# EAGLE design final_mouse (EAGLE 7.3.0)
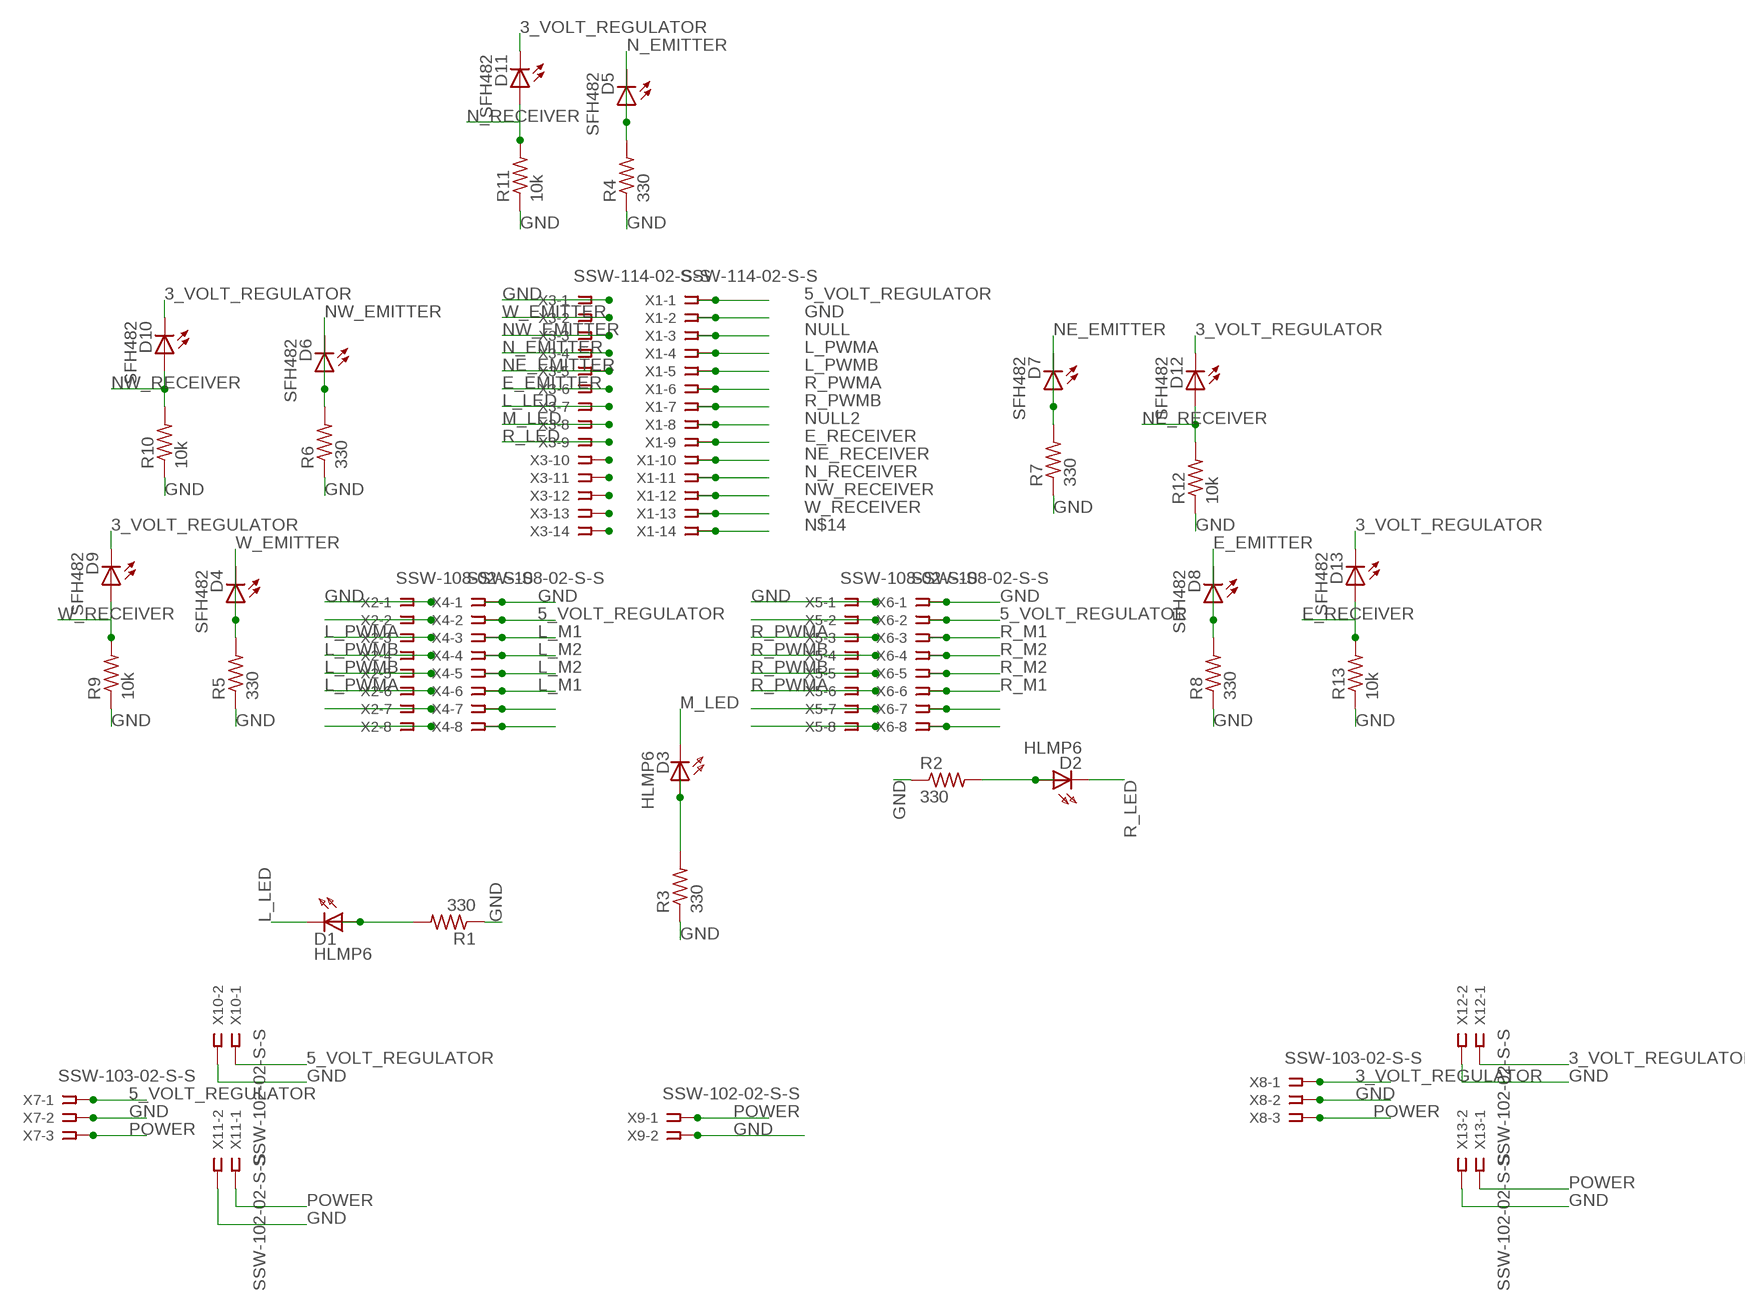
[diagram p0: schematic, sheet 1]

## Parts
D1  HLMP6  [HLMP6]
D2  HLMP6  [HLMP6]
D3  HLMP6  [HLMP6]
D4  SFH482  [SFH482]
D5  SFH482  [SFH482]
D6  SFH482  [SFH482]
D7  SFH482  [SFH482]
D8  SFH482  [SFH482]
D9  SFH482  [SFH482]
D10  SFH482  [SFH482]
D11  SFH482  [SFH482]
D12  SFH482  [SFH482]
D13  SFH482  [SFH482]
R1  330  R-US_0204/2V  [0204V]
R2  330  R-US_0204/2V  [0204V]
R3  330  R-US_0204/2V  [0204V]
R4  330  R-US_0204/2V  [0204V]
R5  330  R-US_0204/2V  [0204V]
R6  330  R-US_0204/2V  [0204V]
R7  330  R-US_0204/2V  [0204V]
R8  330  R-US_0204/2V  [0204V]
R9  10k  R-US_0204/2V  [0204V]
R10  10k  R-US_0204/2V  [0204V]
R11  10k  R-US_0204/2V  [0204V]
R12  10k  R-US_0204/2V  [0204V]
R13  10k  R-US_0204/2V  [0204V]
X1  SSW-114-02-S-S  [SSW-114-02-S-S]
X2  SSW-108-02-S-S  [SSW-108-02-S-S]
X3  SSW-114-02-S-S  [SSW-114-02-S-S]
X4  SSW-108-02-S-S  [SSW-108-02-S-S]
X5  SSW-108-02-S-S  [SSW-108-02-S-S]
X6  SSW-108-02-S-S  [SSW-108-02-S-S]
X7  SSW-103-02-S-S  [SSW-103-02-S-S]
X8  SSW-103-02-S-S  [SSW-103-02-S-S]
X9  SSW-102-02-S-S  [SSW-102-02-S-S]
X10  SSW-102-02-S-S  [SSW-102-02-S-S]
X11  SSW-102-02-S-S  [SSW-102-02-S-S]
X12  SSW-102-02-S-S  [SSW-102-02-S-S]
X13  SSW-102-02-S-S  [SSW-102-02-S-S]

## Nets
3_VOLT_REGULATOR: D9.K(C) D10.K(C) D11.K(C) D12.K(C) D13.K(C) X8.1 X12.1
5_VOLT_REGULATOR: X1.1 X4.2 X6.2 X7.1 X10.1
E_EMITTER: D8.A D8.K(C) R8.2 X3.6
E_RECEIVER: D13.A R13.2 X1.9
GND: R1.1 R2.1 R3.1 R4.1 R5.1 R6.1 R7.1 R8.1 R9.1 R10.1 R11.1 R12.1 R13.1 X1.2 X2.1 X3.1 X4.1 X5.1 X6.1 X7.2 X8.2 X9.2 X10.2 X11.2 X12.2 X13.2
L_LED: D1.K X3.7
L_M1: X4.3 X4.6
L_M2: X4.4 X4.5
L_PWMA: X1.4 X2.3 X2.6
L_PWMB: X1.5 X2.4 X2.5
M_LED: D3.K X3.8
N$1: X5.2
N$2: D1.A R1.2
N$3: D2.A R2.2
N$4: D3.A R3.2
N$7: X2.7
N$8: X2.8
N$9: X5.7
N$10: X5.8
N$14: X1.14
N$16: X4.7
N$17: X4.8
N$20: X6.7
N$21: X6.8
N$24: X3.10
N$25: X3.11
N$26: X3.12
N$27: X3.13
N$28: X3.14
N_EMITTER: D5.A D5.K(C) R4.2 X3.4
N_RECEIVER: D11.A R11.2 X1.11
NE_EMITTER: D7.A D7.K(C) R7.2 X3.5
NE_RECEIVER: D12.A R12.2 X1.10
NULL: X1.3
NULL2: X1.8
NULL3: X2.2
NW_EMITTER: D6.A D6.K(C) R6.2 X3.3
NW_RECEIVER: D10.A R10.2 X1.12
POWER: X7.3 X8.3 X9.1 X11.1 X13.1
R_LED: D2.K X3.9
R_M1: X6.3 X6.6
R_M2: X6.4 X6.5
R_PWMA: X1.6 X5.3 X5.6
R_PWMB: X1.7 X5.4 X5.5
W_EMITTER: D4.A D4.K(C) R5.2 X3.2
W_RECEIVER: D9.A R9.2 X1.13

## Library data of the parts
D1-D3 = display-hp:HLMP6: LED 2mm horizontal; MF: AGILENT TECHNOLOGIES; MPN: HLMP-6500; OC_FARNELL: 1652490; OC_NEWARK: 40K0088
D4-D13 = led:SFH482: IR LED infrared emitting diode, Infineon
R1-R13 = resistor:R-US_: RESISTOR, American symbol
X1 X3 = con-samtec:SSW-114-02-S-S: THROUGH-HOLE .025" SQ POST SOCKET Source: Samtec SSW.pdf; MPN: SSW-114-02-S-S; OC_FARNELL: unknown; OC_NEWARK: 11P9549
X2 X4-X6 = con-samtec:SSW-108-02-S-S: THROUGH-HOLE .025" SQ POST SOCKET Source: Samtec SSW.pdf; MPN: SSW-108-02-S-S; OC_FARNELL: unknown; OC_NEWARK: 11P9448
X7 X8 = con-samtec:SSW-103-02-S-S: THROUGH-HOLE .025" SQ POST SOCKET Source: Samtec SSW.pdf; MPN: SSW-103-02-S-S; OC_FARNELL: unknown; OC_NEWARK: 11P9367
X9-X13 = con-samtec:SSW-102-02-S-S: THROUGH-HOLE .025" SQ POST SOCKET Source: Samtec SSW.pdf; MPN: SSW-102-02-S-S; OC_FARNELL: unknown; OC_NEWARK: 11P9351

## Board
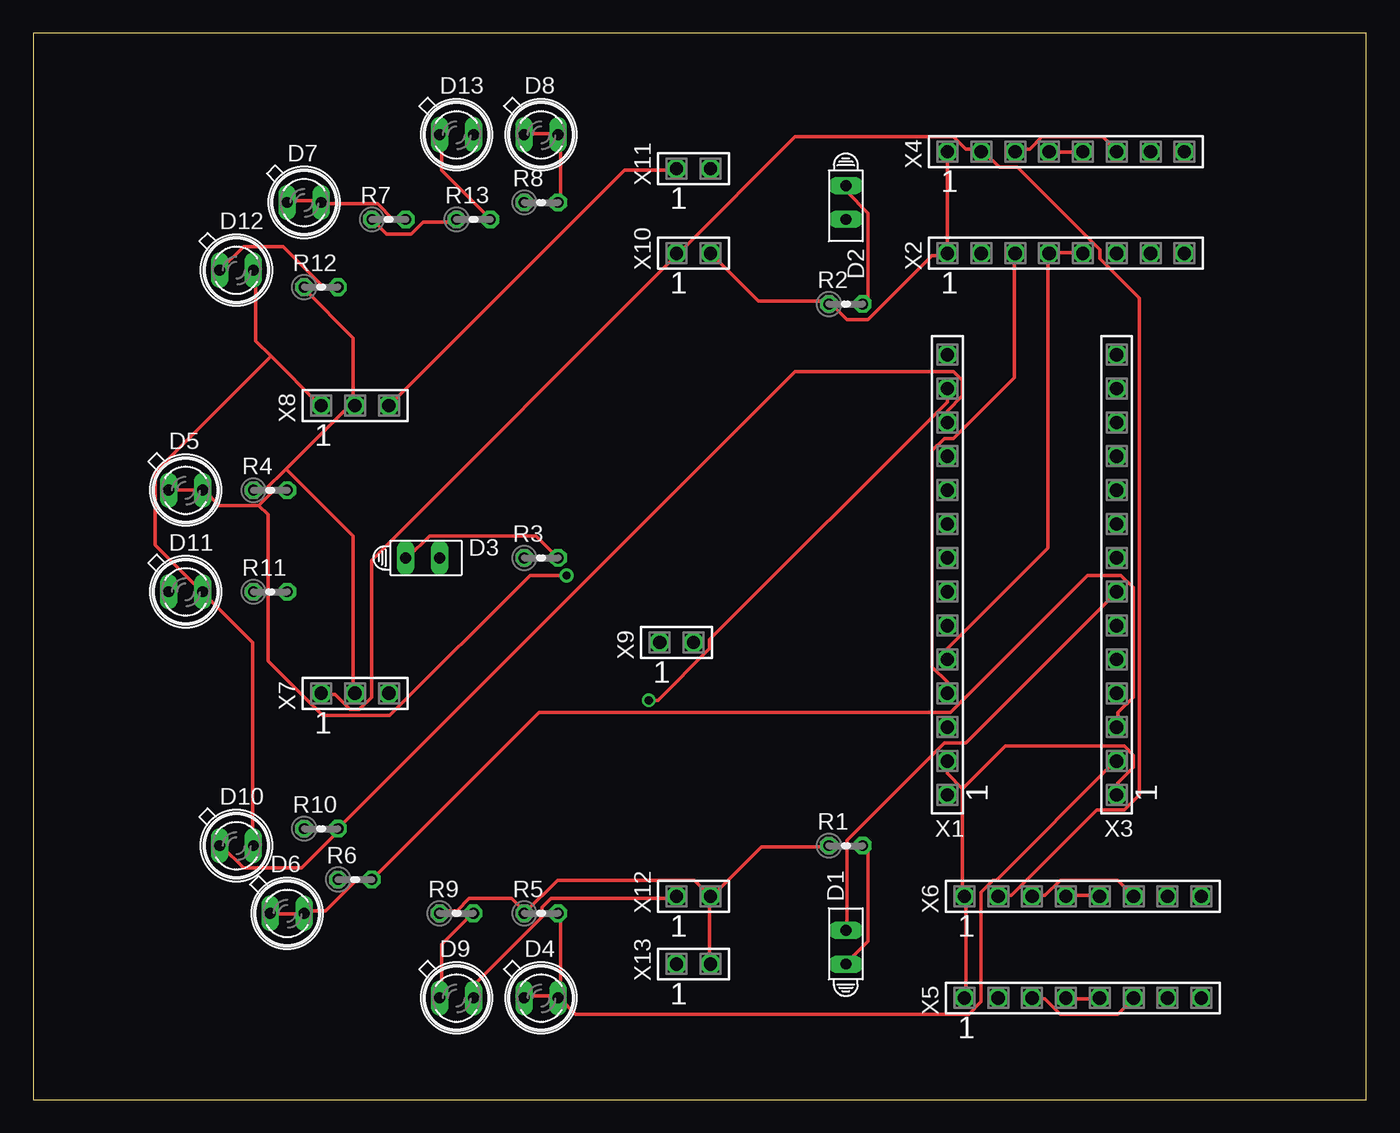
[diagram p1: board, top side]
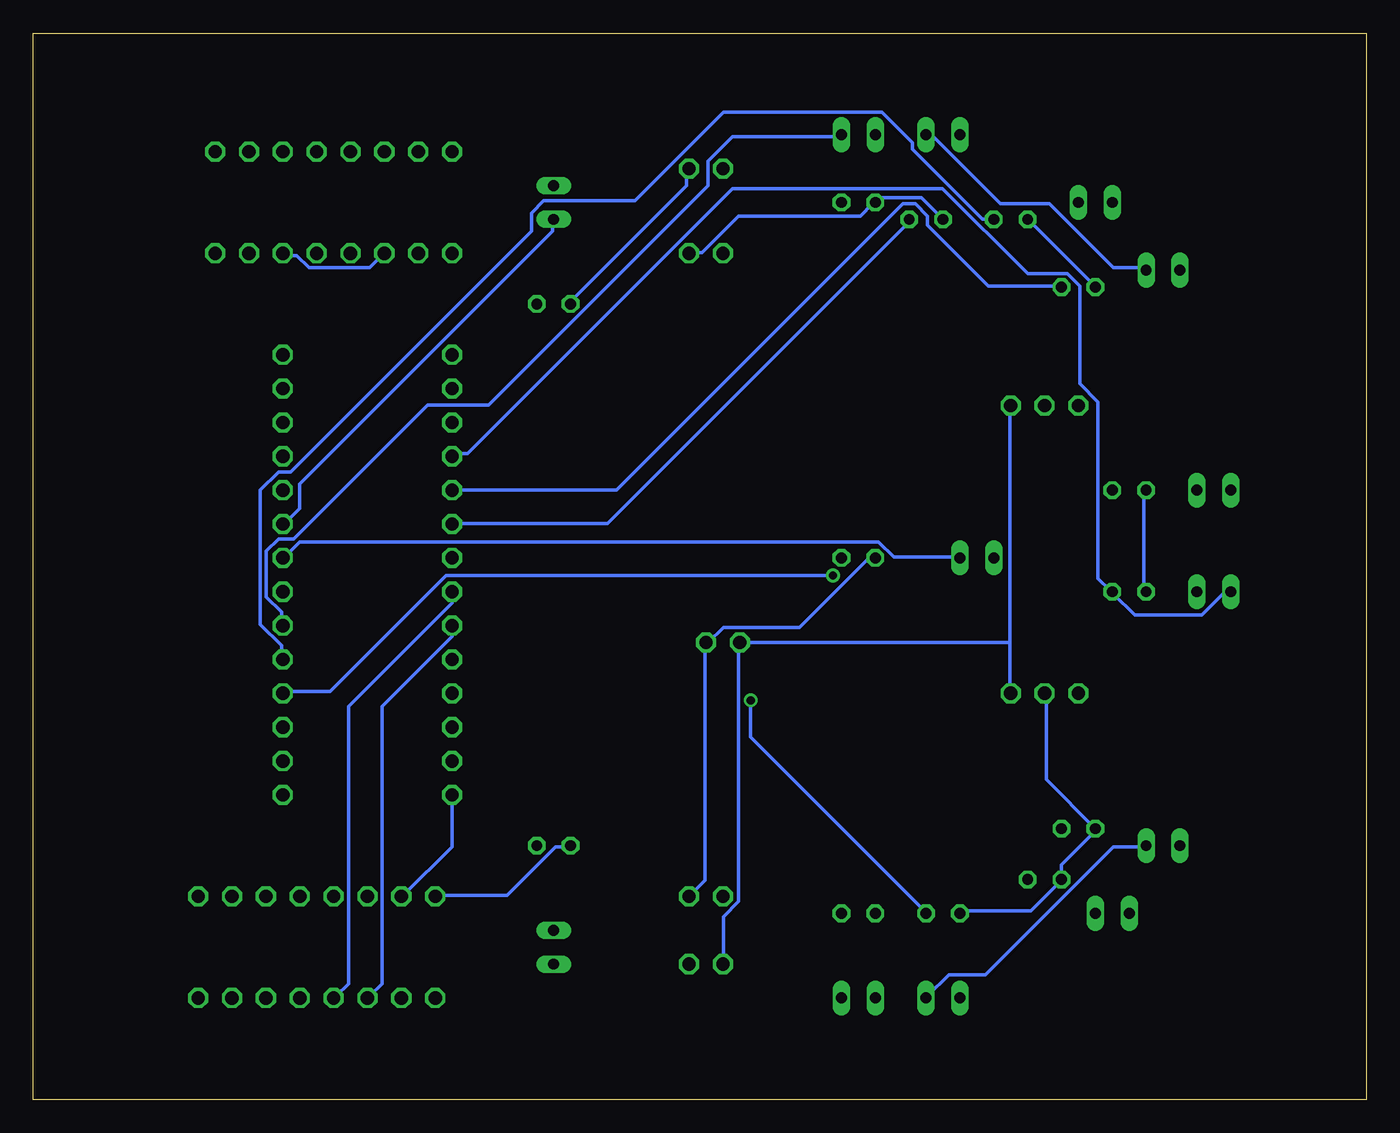
[diagram p2: board, bottom side, seen from below]

Size 100 x 80 mm. Coordinates in mm from the lower left corner, seen from the top.
Outline: 0,0 100,0 100,80 0,80 0,0
Copper layers (1*16): Top 0.035mm / dielectric 1.5mm / Bottom 0.035mm
Design rules "default": minimum track width 10mil, minimum drill 24mil, track to track 8mil, track to pad 8mil, pad to pad 8mil, via to via 8mil, smd to smd 8mil, copper to edge 40mil, drill to drill 8mil, minimum pad ring 10mil, minimum via ring 8mil, stop-mask expansion 4mil, vias tented up to drill 0mil, thermal gap 10mil

### Footprints (pad centres in the part's own frame; a part is rotated, then mirrored left to right if it is on the bottom)
HLMP6 = drill 0.813 long: A -1.27,0; K 1.27,0
SFH482 = drill 0.813 long: A -1.27,0; K 1.27,0
0204V = drill 0.813 octagon: 1 -1.27,0; 2 1.27,0
SSW-114-02-S-S = drill 1 pad 1.5 octagon: 1 -16.51,0; 2 -13.97,0; 3 -11.43,0; 4 -8.89,0; 5 -6.35,0; 6 -3.81,0; 7 -1.27,0; 8 1.27,0; 9 3.81,0; 10 6.35,0; 11 8.89,0; 12 11.43,0; 13 13.97,0; 14 16.51,0
SSW-108-02-S-S = drill 1 pad 1.5 octagon: 1 -8.89,0; 2 -6.35,0; 3 -3.81,0; 4 -1.27,0; 5 1.27,0; 6 3.81,0; 7 6.35,0; 8 8.89,0
SSW-103-02-S-S = drill 1 pad 1.5 octagon: 1 -2.54,0; 2 0,0; 3 2.54,0
SSW-102-02-S-S = drill 1 pad 1.5 octagon: 1 -1.27,0; 2 1.27,0

### Placement (x,y rotation side)
D1  60.96,11.43 90 top
D2  60.96,67.31 270 top
D3  29.21,40.64 0 top
D4  38.1,7.62 0 top
D5  11.43,45.72 0 top
D6  19.05,13.97 0 top
D7  20.32,67.31 0 top
D8  38.1,72.39 0 top
D9  31.75,7.62 0 top
D10  15.24,19.05 0 top
D11  11.43,38.1 0 top
D12  15.24,62.23 0 top
D13  31.75,72.39 0 top
R1  60.96,19.05 0 top
R2  60.96,59.69 0 top
R3  38.1,40.64 0 top
R4  17.78,45.72 0 top
R5  38.1,13.97 0 top
R6  24.13,16.51 0 top
R7  26.67,66.04 0 top
R8  38.1,67.31 0 top
R9  31.75,13.97 0 top
R10  21.59,20.32 0 top
R11  17.78,38.1 0 top
R12  21.59,60.96 0 top
R13  33.02,66.04 0 top
X1  68.58,39.37 90 top
X2  77.47,63.5 0 top
X3  81.28,39.37 90 top
X4  77.47,71.12 0 top
X5  78.74,7.62 0 top
X6  78.74,15.24 0 top
X7  24.13,30.48 0 top
X8  24.13,52.07 0 top
X9  48.26,34.29 0 top
X10  49.53,63.5 0 top
X11  49.53,69.85 0 top
X12  49.53,15.24 0 top
X13  49.53,10.16 0 top

### Tracks (layer width: path | path; a pad name or v marks a point on that pad's centre or on a via)
3_VOLT_REGULATOR
  Top 0.254: 17.83,55.78 21.49,52.12 X8.1 | 17.83,55.78 16.69,56.92 16.69,62.18 D12.K | D10.K 16.46,19.2 16.46,34.29 12.8,37.95 D11.K 12.57,38.18 9.14,41.6 9.14,47.09 17.83,55.78 | D9.K 33.15,7.77 33.15,8.69 38.18,13.72 38.18,14.4 38.86,15.09 48.23,15.09 X12.1
  Bottom 0.254: D13.K 32.92,72.24 32.46,72.24 27.43,67.21 23.77,67.21 18.97,62.41 16.69,62.41 D12.K | D10.K 16.69,18.97 18.97,18.97 28.57,9.37 31.32,9.37 32.92,7.77 D9.K
5_VOLT_REGULATOR
  Top 0.254: X7.1 21.72,30.4 22.63,30.4 23.77,29.26 24.46,29.26 25.38,30.18 25.38,40.46 48.23,63.32 X10.1 48.46,63.55 57.15,72.24 69.04,72.24 69.95,71.32 71.09,71.32 X4.2 71.32,71.09 72.47,69.95 73.84,69.95 80.01,63.78 80.01,63.09 82.98,60.12 82.98,22.86 81.84,21.72 79.78,21.72 73.38,15.32 72.47,15.32 X6.2
  Bottom 0.254: X1.1 68.58,18.97 72.24,15.32 X6.2
E_EMITTER
  Top 0.254: D8.A 37.03,72.47 39.32,72.47 D8.K 39.55,72.24 39.55,67.44 R8.2
  Bottom 0.254: X3.6 81.38,35.66 81.38,36.58 82.53,37.72 82.53,41.15 81.61,42.06 80.47,42.06 70.41,52.12 65.84,52.12 49.38,68.58 49.38,70.41 47.55,72.24 39.55,72.24 D8.K
E_RECEIVER
  Top 0.254: D13.A 30.63,72.24 30.63,69.72 34.29,66.06 R13.2
  Bottom 0.254: X1.9 68.58,43.2 56.92,43.2 34.29,65.84 R13.2
GND
  Top 0.254: X4.1 X2.1 68.58,63.32 67.44,63.32 62.64,58.52 61.04,58.52 59.89,59.66 R2.1 59.66,59.89 54.41,59.89 X10.2 | 24,52.35 24,57.15 20.34,60.81 R12.1 | 24,52.35 24,52.12 X8.2 24,52.35 | R7.1 26.52,64.92 28.35,64.92 29.26,65.84 31.55,65.84 R13.1 | R4.1 17.37,45.72 18.97,47.32 | 24,52.35 18.97,47.32 | R9.1 30.63,14.17 31.77,14.17 32.69,15.09 35.89,15.09 36.8,14.17 R5.1 39.32,16.46 49.61,16.46 50.75,15.32 X12.2 | R1.1 59.66,18.97 54.63,18.97 50.98,15.32 X12.2 | X13.2 50.75,10.29 50.75,15.09 X12.2 | X5.1 69.95,7.77 69.95,15.09 X6.1 69.72,15.32 69.72,23.32 | X1.2 68.58,24.46 69.72,23.32 | 69.72,23.32 72.92,26.52 81.84,26.52 82.53,25.83 82.53,24.92 81.38,23.77 81.38,22.86 X3.1 | 18.97,47.32 24,42.29 24,30.63 X7.2
  Bottom 0.254: X11.2 50.98,69.72 50.98,68.58 59.66,59.89 R2.1 | R11.1 16.69,38.18 16.69,45.72 R4.1 | R13.1 33.38,67.67 36.58,67.67 36.8,67.44 R8.1 37.03,67.21 37.95,66.29 47.09,66.29 49.84,63.55 50.75,63.55 X10.2 | R12.1 20.34,61.04 25.38,66.06 R7.1 | X7.2 24,30.4 24,24 R10.1 20.34,20.12 22.86,17.6 R6.1 22.86,16.46 25.15,14.17 30.4,14.17 R9.1 | R3.1 37.03,40.46 37.49,40.46 42.52,35.43 48.23,35.43 49.38,34.29 X9.2 49.61,34.29 49.61,16.46 50.75,15.32 X12.2 | R1.1 59.89,18.97 60.81,18.97 64.47,15.32 69.72,15.32 X6.1
L_LED
  Top 0.254: D1.K 61.04,12.8 61.04,19.43 68.35,26.75 69.95,26.75 81.15,37.95 X3.7
L_M1
  Top 0.254: X4.3 73.84,71.32 74.75,71.32 75.67,72.24 80.24,72.24 81.15,71.32 X4.6
L_M2
  Top 0.254: X4.4 76.35,71.09 78.64,71.09 X4.5
L_PWMA
  Top 0.254: X1.4 68.58,31.32 67.44,32.46 67.44,48.69 68.35,49.61 69.04,49.61 73.61,54.18 73.61,63.32 X2.3
  Bottom 0.254: X2.3 74.75,62.41 79.32,62.41 80.24,63.32 81.15,63.32 X2.6
L_PWMB
  Top 0.254: X1.5 68.58,33.83 76.12,41.38 76.12,63.32 X2.4 76.35,63.55 78.64,63.55 X2.5
M_LED
  Bottom 0.254: D3.K 30.63,40.69 35.43,40.69 36.58,41.83 80.01,41.83 81.15,40.69 X3.8
N$2
  Top 0.254: D1.A 61.04,10.29 62.64,11.89 62.64,18.75 62.41,18.97 R1.2
N$3
  Top 0.254: D2.A 61.04,68.58 61.04,68.12 62.64,66.52 62.64,60.12 62.41,59.89 R2.2
N$4
  Top 0.254: R3.2 37.72,42.29 29.72,42.29 28.12,40.69 D3.A
N_EMITTER  (via drill 0.61)
  Top 0.254: D5.A D5.K 12.8,45.72 13.95,44.58 16.92,44.58 | R4.2 18.06,45.72 16.92,44.58 | v40.01,39.32 37.26,39.32 26.75,28.8 21.72,28.8 17.6,32.92 17.6,43.89 16.92,44.58
  Bottom 0.254: v40.01,39.32 69.04,39.32 77.72,30.63 81.15,30.63 X3.4
N_RECEIVER
  Bottom 0.254: D11.A 10.29,37.95 10.74,37.95 12.34,36.35 17.37,36.35 18.97,37.95 R11.2 19.2,38.18 20.12,39.09 20.12,52.35 21.49,53.72 21.49,61.04 22.4,61.95 25.38,61.95 31.77,68.35 47.55,68.35 67.44,48.46 68.58,48.46 X1.11
NE_EMITTER
  Top 0.254: D7.A 19.2,67.44 21.49,67.44 D7.K 21.72,67.21 25.83,67.21 26.98,66.06 27.89,66.06 R7.2
  Bottom 0.254: X3.5 81.38,33.15 81.38,34.06 82.98,35.66 82.98,45.72 81.61,47.09 80.7,47.09 62.64,65.15 62.64,66.52 61.72,67.44 54.86,67.44 48.23,74.07 36.35,74.07 34.06,71.78 34.06,71.32 28.8,66.06 28.12,66.06 R7.2
NE_RECEIVER
  Top 0.254: R12.2 22.86,61.04 21.72,61.04 18.75,64.01 15.77,64.01 14.17,62.41 D12.A
  Bottom 0.254: X1.10 56.24,45.72 34.75,67.21 33.83,67.21 32.92,66.29 32.92,65.61 28.35,61.04 22.86,61.04 R12.2
NW_EMITTER
  Top 0.254: D6.A 17.83,13.95 20.12,13.95 D6.K 20.34,14.17 21.95,14.17 24.23,16.46 25.38,16.46 R6.2 25.6,16.69 37.95,29.03 68.81,29.03 79.1,39.32 81.61,39.32 82.53,38.41 82.53,30.18 81.38,29.03 81.38,28.12 X3.3
NW_RECEIVER
  Top 0.254: D10.A 14.17,18.97 15.77,17.37 20.12,17.37 22.86,20.12 R10.2 22.86,20.34 57.15,54.63 69.04,54.63 69.72,53.95 69.72,52.81 68.58,51.66 X1.12
POWER
  Top 0.254: X11.1 48.23,69.72 44.35,69.72 26.75,52.12 X8.3
  Bottom 0.254: 26.75,34.29 26.75,51.89 X8.3 | 26.75,34.29 26.75,30.63 X7.3 | 26.75,34.29 X9.1 47.09,34.29 47.09,14.86 48.23,13.72 48.23,10.29 X13.1
R_LED
  Bottom 0.254: D2.K 61.04,65.84 61.04,65.15 80.01,46.18 80.01,44.35 81.15,43.2 X3.9
R_M1
  Top 0.254: X6.3 74.98,15.32 75.89,15.32 77.04,16.46 81.38,16.46 82.53,15.32 X6.6
R_M2
  Top 0.254: X6.4 77.5,15.32 80.01,15.32 X6.5
R_PWMA
  Top 0.254: X5.3 74.98,7.54 75.89,7.54 77.04,6.4 81.38,6.4 82.53,7.54 X5.6
  Bottom 0.254: X1.6 68.58,34.75 73.84,29.49 73.84,8.69 74.75,7.77 X5.3
R_PWMB
  Top 0.254: X5.4 77.5,7.54 80.01,7.54 X5.5
  Bottom 0.254: X1.7 68.58,37.26 76.35,29.49 76.35,8.69 77.27,7.77 X5.4
W_EMITTER
  Top 0.254: D4.A 37.03,7.77 39.32,7.77 D4.K | R5.2 39.55,13.95 39.55,7.77 D4.K | X3.2 81.15,25.38 72.24,16.46 72.01,16.46 71.09,15.54 71.09,7.32 70.18,6.4 40.69,6.4 39.55,7.54 D4.K
W_RECEIVER  (via drill 0.61)
  Top 0.254: D9.A 30.63,7.77 30.63,11.66 32.92,13.95 R9.2 | X1.13 68.58,52.35 50.75,34.52 50.75,33.83 46.86,29.95 v46.18,29.95
  Bottom 0.254: v46.18,29.95 46.18,27.2 33.15,14.17 R9.2